# Altium schematic sheet fpga-serdes-inside.SchDoc: FPGA - Serdes
size Letter; CheckedBy: E. Chiu; CompanyName: Brinton Engineering, LLC; DrawnBy: J. Brinton; Engineer: J. Brinton; Address1: 3479 Edison Way; Address2: Menlo Park CA 94025; Address3: +1 (877) 778-8435; Address4: brintonengineering.com; Revision: 1; SheetNumber: 15; SheetTotal: 60
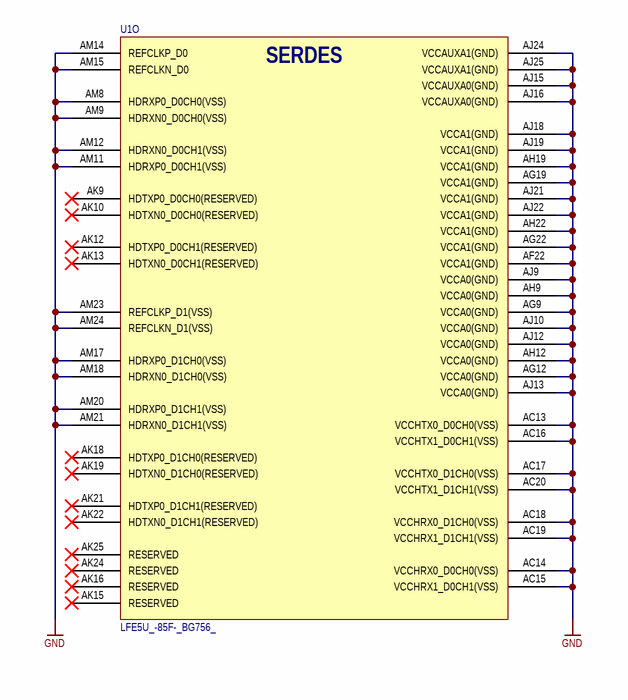
[diagram p0: fpga-serdes-inside.SchDoc]

## Parts
U1  LFE5U_-85F-_BG756_  [caBGA756]  (part O of 19)

## Nets
GND: U1.AC13(VCCHTX0_D0CH0(VSS)) U1.AC14(VCCHRX0_D0CH0(VSS)) U1.AC15(VCCHRX1_D0CH1(VSS)) U1.AC16(VCCHTX1_D0CH1(VSS)) U1.AC17(VCCHTX0_D1CH0(VSS)) U1.AC18(VCCHRX0_D1CH0(VSS)) U1.AC19(VCCHRX1_D1CH1(VSS)) U1.AC20(VCCHTX1_D1CH1(VSS)) U1.AF22(VCCA1(GND)) U1.AG9(VCCA0(GND)) U1.AG12(VCCA0(GND)) U1.AG19(VCCA1(GND)) U1.AG22(VCCA1(GND)) U1.AH9(VCCA0(GND)) U1.AH12(VCCA0(GND)) U1.AH19(VCCA1(GND)) U1.AH22(VCCA1(GND)) U1.AJ9(VCCA0(GND)) U1.AJ10(VCCA0(GND)) U1.AJ12(VCCA0(GND)) U1.AJ13(VCCA0(GND)) U1.AJ15(VCCAUXA0(GND)) U1.AJ16(VCCAUXA0(GND)) U1.AJ18(VCCA1(GND)) U1.AJ19(VCCA1(GND)) U1.AJ21(VCCA1(GND)) U1.AJ22(VCCA1(GND)) U1.AJ24(VCCAUXA1(GND)) U1.AJ25(VCCAUXA1(GND)) U1.AM8(HDRXP0_D0CH0(VSS)) U1.AM9(HDRXN0_D0CH0(VSS)) U1.AM11(HDRXP0_D0CH1(VSS)) U1.AM12(HDRXN0_D0CH1(VSS)) U1.AM14(REFCLKP_D0) U1.AM15(REFCLKN_D0) U1.AM17(HDRXP0_D1CH0(VSS)) U1.AM18(HDRXN0_D1CH0(VSS)) U1.AM20(HDRXP0_D1CH1(VSS)) U1.AM21(HDRXN0_D1CH1(VSS)) U1.AM23(REFCLKP_D1(VSS)) U1.AM24(REFCLKN_D1(VSS))

Not connected (* = marked no-connect by the designer): U1 AK9(HDTXP0_D0CH0(RESERVED))* AK10(HDTXN0_D0CH0(RESERVED))* AK12(HDTXP0_D0CH1(RESERVED))* AK13(HDTXN0_D0CH1(RESERVED))* AK15(RESERVED)* AK16(RESERVED)* AK18(HDTXP0_D1CH0(RESERVED))* AK19(HDTXN0_D1CH0(RESERVED))* AK21(HDTXP0_D1CH1(RESERVED))* AK22(HDTXN0_D1CH1(RESERVED))* AK24(RESERVED)* AK25(RESERVED)*

## Notes on the sheet
- Title
- Engineer
- Revision
- Drawn By
- Checked By
- Date
- Sheet
- of
- (in symbol LFE5U_-85F-_BG756_, part O) SERDES

## Library data of the parts
U1 = LFE5U_-85F-_BG756_: ECP5 FPGA, 85k LUT, 756-caBGA; Manufacturer: Lattice Semiconductor; Manufacturer P/N: LFE5U_-85F-_BG756_